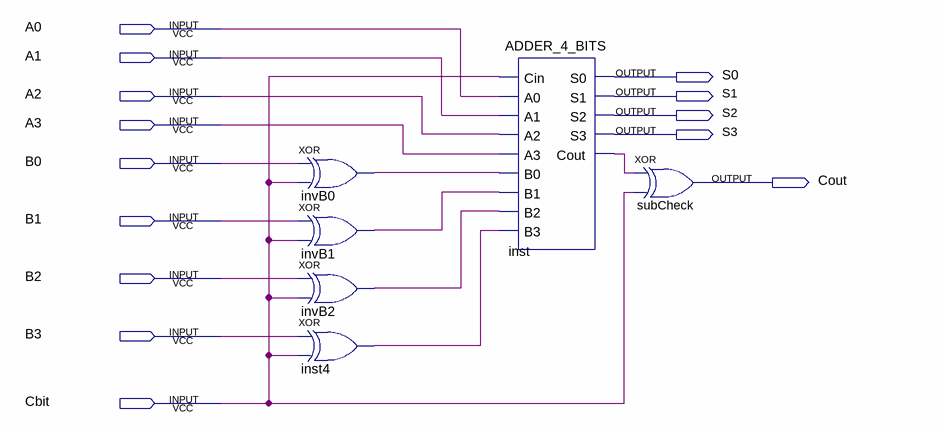
[diagram p0: schematic sheet]
// Quartus schematic Full_Adder_Subtractor.bdf as structural Verilog: 6 symbols, 14 pins
module Full_Adder_Subtractor (
  input  A0,
  input  A1,
  input  A2,
  input  A3,
  input  B0,
  input  B1,
  input  B2,
  input  B3,
  input  Cbit,
  output S0,
  output S1,
  output S2,
  output S3,
  output Cout
);

  wire inst4_out, inst_cout, invB0_out, invB1_out, invB2_out;

  xor invB0 (invB0_out, B0, Cbit);
  xor invB1 (invB1_out, B1, Cbit);
  xor invB2 (invB2_out, B2, Cbit);
  xor inst4 (inst4_out, B3, Cbit);
  ADDER_4_BITS inst (
    .Cin(Cbit), .A0(A0), .A1(A1), .A2(A2), .A3(A3), .B0(invB0_out), .B1(invB1_out), .B2(invB2_out),
    .B3(inst4_out), .S0(S0), .S1(S1), .S2(S2), .S3(S3), .Cout(inst_cout));
  xor subCheck (Cout, inst_cout, Cbit);
endmodule
